# Altium schematic sheet ADCduinoModule.SchDoc: Название платы
size 594 x 420 mm; ApprovedBy: Рогов; CheckedBy: Фамилия проверяющего; DrawnBy: Фамилия разработчика; DocumentNumber: Введите номер платы + Э3; SheetNumber: пусто если листов 1, иначе 1; SheetTotal: количество листов; Format: A2; DocumentType: тип схемы; Title1str: (вторая строка при необходимости); ImagePath: Введите номер платы
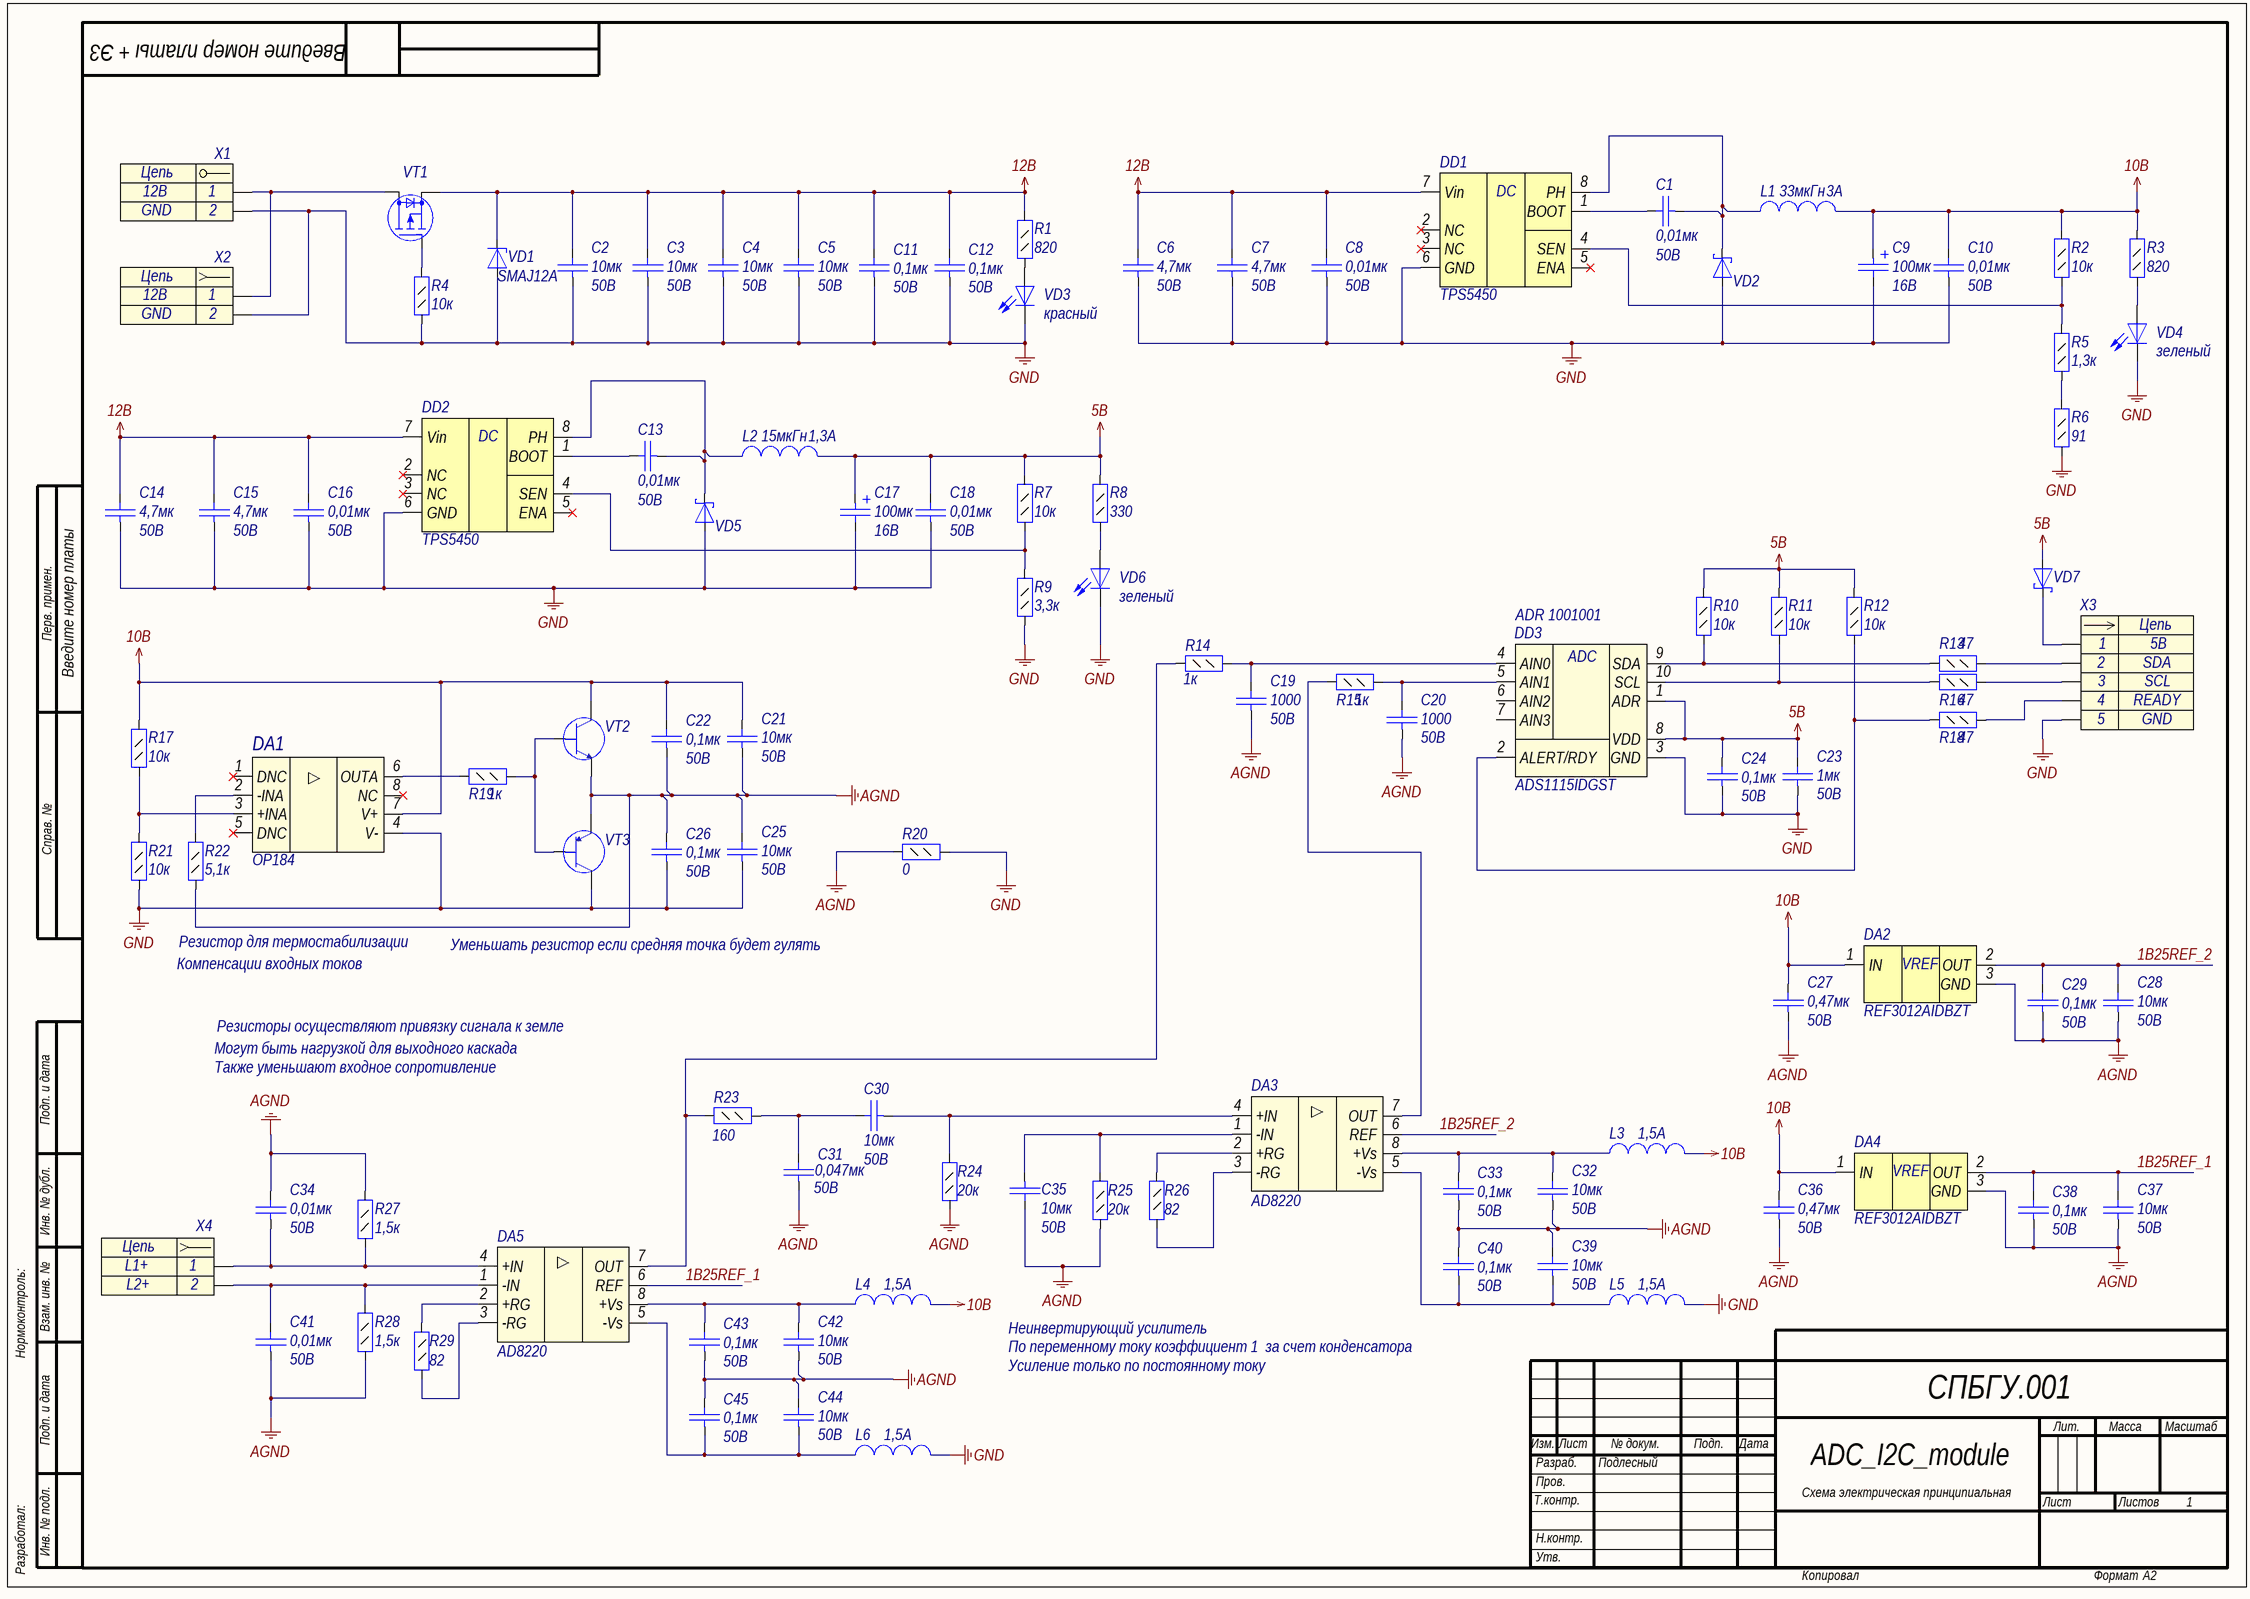
[diagram p0: ADCduinoModule.SchDoc]

## Parts
C1  value 0,01мк  Voltage: 50B  [C0805]  (hidden comment: Capacitor)
C2  value 10мк  Voltage: 50В  [C1210]  (hidden comment: Capacitor)
C3  value 10мк  Voltage: 50В  [C1210]  (hidden comment: Capacitor)
C4  value 10мк  Voltage: 50В  [C1210]  (hidden comment: Capacitor)
C5  value 10мк  Voltage: 50В  [C1210]  (hidden comment: Capacitor)
C6  value 4,7мк  Voltage: 50В  [C1206]  (hidden comment: Capacitor)
C7  value 4,7мк  Voltage: 50В  [C1206]  (hidden comment: Capacitor)
C8  value 0,01мк  Voltage: 50B  [C0805]  (hidden comment: Capacitor)
C9  value 100мк  Voltage: 16В  [TANTAL CASE D]  (hidden comment: Capacitor_pol)
C10  value 0,01мк  Voltage: 50B  [C0805]  (hidden comment: Capacitor)
C11  value 0,1мк  Voltage: 50B  [C0805]  (hidden comment: Capacitor)
C12  value 0,1мк  Voltage: 50B  [C0805]  (hidden comment: Capacitor)
C13  value 0,01мк  Voltage: 50B  [C0805]  (hidden comment: Capacitor)
C14  value 4,7мк  Voltage: 50В  [C1206]  (hidden comment: Capacitor)
C15  value 4,7мк  Voltage: 50В  [C1206]  (hidden comment: Capacitor)
C16  value 0,01мк  Voltage: 50B  [C0805]  (hidden comment: Capacitor)
C17  value 100мк  Voltage: 16В  [TANTAL CASE D]  (hidden comment: Capacitor_pol)
C18  value 0,01мк  Voltage: 50B  [C0805]  (hidden comment: Capacitor)
C19  value 1000  Voltage: 50В  [C0805]  (hidden comment: Capacitor)
C20  value 1000  Voltage: 50В  [C0805]  (hidden comment: Capacitor)
C21  value 10мк  Voltage: 50В  [C1210]  (hidden comment: Capacitor)
C22  value 0,1мк  Voltage: 50B  [C0805]  (hidden comment: Capacitor)
C23  value 1мк  Voltage: 50B  [C0805]  (hidden comment: Capacitor)
C24  value 0,1мк  Voltage: 50B  [C0805]  (hidden comment: Capacitor)
C25  value 10мк  Voltage: 50В  [C1210]  (hidden comment: Capacitor)
C26  value 0,1мк  Voltage: 50B  [C0805]  (hidden comment: Capacitor)
C27  value 0,47мк  Voltage: 50B  [C0805]  (hidden comment: Capacitor)
C28  value 10мк  Voltage: 50В  [C1210]  (hidden comment: Capacitor)
C29  value 0,1мк  Voltage: 50B  [C0805]  (hidden comment: Capacitor)
C30  value 10мк  Voltage: 50В  [C1210]  (hidden comment: Capacitor)
C31  value 0,047мк  Voltage: 50B  [C0805]  (hidden comment: Capacitor)
C32  value 10мк  Voltage: 50В  [C1210]  (hidden comment: Capacitor)
C33  value 0,1мк  Voltage: 50B  [C0805]  (hidden comment: Capacitor)
C34  value 0,01мк  Voltage: 50B  [C0805]  (hidden comment: Capacitor)
C35  value 10мк  Voltage: 50В  [C1210]  (hidden comment: Capacitor)
C36  value 0,47мк  Voltage: 50B  [C0805]  (hidden comment: Capacitor)
C37  value 10мк  Voltage: 50В  [C1210]  (hidden comment: Capacitor)
C38  value 0,1мк  Voltage: 50B  [C0805]  (hidden comment: Capacitor)
C39  value 10мк  Voltage: 50В  [C1210]  (hidden comment: Capacitor)
C40  value 0,1мк  Voltage: 50B  [C0805]  (hidden comment: Capacitor)
C41  value 0,01мк  Voltage: 50B  [C0805]  (hidden comment: Capacitor)
C42  value 10мк  Voltage: 50В  [C1210]  (hidden comment: Capacitor)
C43  value 0,1мк  Voltage: 50B  [C0805]  (hidden comment: Capacitor)
C44  value 10мк  Voltage: 50В  [C1210]  (hidden comment: Capacitor)
C45  value 0,1мк  Voltage: 50B  [C0805]  (hidden comment: Capacitor)
DA1  OP184  [SO8]
DA2  Part Number: REF3012AIDBZT  [SOT23-3]  (hidden comment: REF30xx)
DA3  AD8220  [MSOP8]
DA4  Part Number: REF3012AIDBZT  [SOT23-3]  (hidden comment: REF30xx)
DA5  AD8220  [MSOP8]
DD1  TPS5450  [SO Powerpad8]
DD2  TPS5450  [SO Powerpad8]
DD3  ADS1115IDGST  [MSOP10]
L1  value 33мкГн  Rated Current: 3A  [IND_12.8x12.8]  (hidden comment: Inductor)
L2  value 15мкГн  Rated Current: 1,3A  [SDR0604]  (hidden comment: Inductor)
L3  Rated Current: 1,5A  [L0603]  (hidden comment: Inductor)
L4  Rated Current: 1,5A  [L0603]  (hidden comment: Inductor)
L5  Rated Current: 1,5A  [L0603]  (hidden comment: Inductor)
L6  Rated Current: 1,5A  [L0603]  (hidden comment: Inductor)
R1  value 820  [R0805]  (hidden comment: Resistor_0,125Вт)
R2  value 10к  [R0805]  (hidden comment: Resistor_0,125Вт)
R3  value 820  [R0805]  (hidden comment: Resistor_0,125Вт)
R4  value 10к  [R0805]  (hidden comment: Resistor_0,125Вт)
R5  value 1,3к  [R0805]  (hidden comment: Resistor_0,125Вт)
R6  value 91  [R0805]  (hidden comment: Resistor_0,125Вт)
R7  value 10к  [R0805]  (hidden comment: Resistor_0,125Вт)
R8  value 330  [R0805]  (hidden comment: Resistor_0,125Вт)
R9  value 3,3к  [R0805]  (hidden comment: Resistor_0,125Вт)
R10  value 10к  [R0805]  (hidden comment: Resistor_0,125Вт)
R11  value 10к  [R0805]  (hidden comment: Resistor_0,125Вт)
R12  value 10к  [R0805]  (hidden comment: Resistor_0,125Вт)
R13  value 47  [R0805]  (hidden comment: Resistor_0,125Вт)
R14  value 1к  [R0805]  (hidden comment: Resistor_0,125Вт)
R15  value 1к  [R0805]  (hidden comment: Resistor_0,125Вт)
R16  value 47  [R0805]  (hidden comment: Resistor_0,125Вт)
R17  value 10к  [R0805]  (hidden comment: Resistor_0,125Вт)
R18  value 47  [R0805]  (hidden comment: Resistor_0,125Вт)
R19  value 1к  [R0805]  (hidden comment: Resistor_0,125Вт)
R20  value 0  [R0805]  (hidden comment: Resistor_0,125Вт)
R21  value 10к  [R0805]  (hidden comment: Resistor_0,125Вт)
R22  value 5,1к  [R0805]  (hidden comment: Resistor_0,125Вт)
R23  value 160  [R0805]  (hidden comment: Resistor_0,125Вт)
R24  value 20к  [R0805]  (hidden comment: Resistor_0,125Вт)
R25  value 20к  [R0805]  (hidden comment: Resistor_0,125Вт)
R26  value 82  [R0805]  (hidden comment: Resistor_0,125Вт)
R27  value 1,5к  [R0805]  (hidden comment: Resistor_0,125Вт)
R28  value 1,5к  [R0805]  (hidden comment: Resistor_0,125Вт)
R29  value 82  [R0805]  (hidden comment: Resistor_0,125Вт)
VD1  Part Number: SMAJ12A  [SMA]  (hidden comment: DiodeZener)
VD2  DiodeSchottky  [SMA]  (value not drawn)
VD3  красный  [L_0805]
VD4  зеленый  [L_0805]
VD5  DiodeSchottky  [SMA]  (value not drawn)
VD6  зеленый  [L_0805]
VD7  DiodeSchottky  [SMA]  (value not drawn)
VT1  P-MOSFET  [DPAK]  (value not drawn)
VT2  BJT NPN  [SOT-223]  (value not drawn)
VT3  BJT PNP  [SOT-223]  (value not drawn)
X1  Header_2_trm  [TERMINAL-2WAY-3.5MM]  (value not drawn)
X2  Header_2_sct  [DS-210]  (value not drawn)
X3  Header_5_plg  [PLS-5]  (value not drawn)
X4  Header_2_sct  [TAB_2PAD]  (value not drawn)

## Nets
5B: C17.1 C18.2 C23.2 C24.2 DD3.1(ADR) DD3.8(VDD) L2.2 R7.2 R8.2 R10.2 R11.2 R12.2 VD7.2(A)
10B: C9.1 C10.2 C21.2 C22.2 C27.2 C36.2 DA1.7(V+) DA2.1(IN) DA4.1(IN) L1.2 L3.2 L4.2 R2.2 R3.2 R17.2 VT2.3
12B: C2.2 C3.2 C4.2 C5.2 C6.2 C7.2 C8.2 C11.2 C12.2 C14.2 C15.2 C16.2 DD1.7(Vin) DD2.7(Vin) R1.2 VD1.1(K) VT1.3(S)
AGND: C19.1 C20.1 C21.1 C22.1 C25.2 C26.2 C27.1 C28.1 C29.1 C31.1 C32.1 C33.1 C34.2 C35.2 C36.1 C37.1 C38.1 C39.2 C40.2 C41.1 C42.1 C43.1 C44.2 C45.2 DA2.3(GND) DA4.3(GND) R20.1 R22.1 R24.1 R25.1 R27.2 R28.1 VT2.2 VT3.2
GND: C2.1 C3.1 C4.1 C5.1 C6.1 C7.1 C8.1 C9.2 C10.1 C11.1 C12.1 C14.1 C15.1 C16.1 C17.2 C18.1 C23.1 C24.1 C25.1 C26.1 DA1.4(V-) DD1.6(GND) DD2.6(GND) DD3.3(GND) L5.2 L6.2 R4.1 R6.1 R9.1 R20.2 R21.1 VD1.2(A) VD2.2(A) VD3.1(K) VD4.1(K) VD5.2(A) VD6.1(K) VT3.3 X1.2 X2.2 X3.5
1B25REF_1: C37.2 C38.2 DA4.2(OUT) DA5.6(REF)
1B25REF_2: C28.2 C29.2 DA2.2(OUT) DA3.6(REF)
NetC1_1: C1.1 DD1.8(PH) L1.1 VD2.1(K)
NetC1_2: C1.2 DD1.1(BOOT)
NetC13_1: C13.1 DD2.8(PH) L2.1 VD5.1(K)
NetC13_2: C13.2 DD2.1(BOOT)
NetC19_2: C19.2 DD3.4(AIN0) R14.2
NetC20_2: C20.2 DD3.5(AIN1) R15.2
NetC30_1: C30.1 DA3.4(+IN) R24.2
NetC30_2: C30.2 C31.2 R23.2
NetC32_2: C32.2 C33.2 DA3.8(+Vs) L3.1
NetC34_1: C34.1 DA5.4(+IN) R27.1 X4.1
NetC35_1: C35.1 DA3.1(-IN) R25.2
NetC39_1: C39.1 C40.1 DA3.5(-Vs) L5.1
NetC41_2: C41.2 DA5.1(-IN) R28.2 X4.2
NetC42_2: C42.2 C43.2 DA5.8(+Vs) L4.1
NetC44_1: C44.1 C45.1 DA5.5(-Vs) L6.1
NetDA1_2: DA1.2(-INA) R22.2
NetDA1_3: DA1.3(+INA) R17.1 R21.2
NetDA1_6: DA1.6(OUTA) R19.1
NetDA3_2: DA3.2(+RG) R26.1
NetDA3_3: DA3.3(-RG) R26.2
NetDA3_7: DA3.7(OUT) R15.1
NetDA5_2: DA5.2(+RG) R29.1
NetDA5_3: DA5.3(-RG) R29.2
NetDA5_7: DA5.7(OUT) R14.1 R23.1
NetDD1_4: DD1.4(SEN) R2.1 R5.2
NetDD2_4: DD2.4(SEN) R7.1 R9.2
NetDD3_2: DD3.2(ALERT/RDY) R12.1 R18.1
NetDD3_9: DD3.9(SDA) R10.1 R13.1
NetDD3_10: DD3.10(SCL) R11.1 R16.1
NetR1_1: R1.1 VD3.2(A)
NetR3_1: R3.1 VD4.2(A)
NetR4_2: R4.2 VT1.1(G)
NetR5_1: R5.1 R6.2
NetR8_1: R8.1 VD6.2(A)
NetR13_2: R13.2 X3.2
NetR16_2: R16.2 X3.3
NetR18_2: R18.2 X3.4
NetR19_2: R19.2 VT2.1 VT3.1
NetVD7_1: VD7.1(K) X3.1
NetVT1_2: VT1.2(D) X1.1 X2.1

Not connected (* = marked no-connect by the designer): DA1 1(DNC)* 5(DNC)* 8(NC)*; DD1 2(NC)* 3(NC)* 5(ENA)*; DD2 2(NC)* 3(NC)* 5(ENA)*; DD3 6(AIN2) 7(AIN3)

## Notes on the sheet
- Перв. примен.
- (near DD3) ADR 1001001
- Справ. №
- Компенсации входных токов
- Резистор для термостабилизации
- Уменьшать резистор если средняя точка будет гулять
- Могут быть нагрузкой для выходного каскада
- Также уменьшают входное сопротивление
- Резисторы осуществляют привязку сигнала к земле
- Подп. и дата
- Инв. № дубл.
- Нормоконтроль:
- Взам. инв. №
- Неинвертирующий усилитель
- По переменному току коэффициент 1  за счет конденсатора
- Усиление только по постоянному току
- СПБГУ.001
- Изм.
- Лист
- № докум.
- Подп.
- Дата
- Лит.
- Масса
- Масштаб
- Т.контр.
- Пров.
- Разраб.
- Подлесный
- Схема электрическая принципиальная
- ADC_I2C_module
- Листов
- 1
- Разработал:
- Инв. № подл.
- Н.контр.
- Утв.
- Копировал
- Формат
- (in symbol connect1) Цепь
- (in symbol connect6) Цепь
- (in symbol connect34) Цепь
- (in symbol connect57) Цепь
- (in symbol interf6) ADC
- (in symbol pwr12) DC
- (in symbol REF3012AIDBZT) VREF

## Library data of the parts
C1 C8 C10 C13 C16 C18 C34 C41 = cap136: Конденсатор; Part Name: Ceramic; Manufacture: Murata; Part Number: GRM216R71H103K; id: cap136; TKE: X7R
C2-C5 C21 C25 C28 C30 C32 C35 C37 C39 C42 C44 = cap205: Конденсатор; Part Name: Ceramic; Manufacture: Murata; Part Number: GRM32ER71H106K; id: cap205; TKE: X7R
C6 C7 C14 C15 = cap188: Конденсатор; Part Name: Ceramic; Manufacture: Murata; Part Number: GRM31CR71H475KA12L; id: cap188; TKE: X7R
C9 C17 = cap209: Конденсатор полярный; Part Name: Tantal; Manufacture: Vishay; Part Number: 293D107X9016D2TE3; id: cap209
C11 C12 C22 C24 C26 C29 C33 C38 C40 C43 C45 = cap141: Конденсатор; Part Name: Ceramic; Manufacture: Murata; Part Number: GRM21BR71H104K**; id: cap141; TKE: X7R
C19 C20 = cap165: Конденсатор; Part Name: Ceramic; Manufacture: Murata; Part Number: GRM216R71H102K*; id: cap165; TKE: X7R
C23 = cap151: Конденсатор; Part Name: Ceramic; Manufacture: Murata; Part Number: GRM21BR71H105K; id: cap151; TKE: X7R
C27 C36 = cap148: Конденсатор; Part Name: Ceramic; Manufacture: Murata; Part Number: GRM219R71C474K; id: cap148; TKE: X7R
C31 = cap140: Конденсатор; Part Name: Ceramic; Manufacture: Murata; Part Number: GRM21BR71H473K; id: cap140; TKE: X7R
DA1 = amp16: Precision Rail-to-Rail / Input and Output Operational Amplifiers; Part Number: OP184ESZ; Manufacture: Analog Devices; id: amp16; Rail-to-rail: yes; Supply Voltage: 3-36B; Supply Current max: 1,45mA; Bandwidth: 3,25MHz; Input Bias Current: 60nA; CMRR: 86dB; PSRR: 76dB; Offset voltage: 165uB; Channels: 1; Part Name: Precision Rail-to-Rail Input and Output
DA2 DA4 = REF3012AIDBZT: CMOS Voltage Reference; Manufacturer: Texas Instruments; id: ref2; Voltage min stabilize: 1,25B; Max input voltage: 5,5B; Accuracy: 0,002; Output current: 25mA; Part Name: CMOS Voltage Reference
DA3 DA5 = amp15: JFET Input Instrumentation Amplifier; Part Number: AD8220ARMZ; Manufacture: Analog Devices; id: amp15; Rail-to-rail: yes; Supply Voltage: 4,5В–36В or (+-)2,25В-(+-)18B; Supply Current max: 750uA; Bandwidth: 1,5MHz; Input Bias Current: 25pA; CMRR: 95dB; PSRR: 100dB; Offset voltage: (+-)0,125uB; Channels: 1; Part Name: JFET Input Instrumentation Amplifier
DD1 DD2 = pwr12: 5-A, Wide Input Range, Step-Down Converter; Manufacturer: Texas Instruments; id: pwr12; Input Voltage: 5,5 - 36B; Output Voltage: Adj; Current: 5A; Part Name: Step-Down Converter; Type: Impulse; Part Number: TPS5450
DD3 = interf6: Ultra-Small, Low-Power, 16-Bit  Analog-to-Digital Converter with Internal Reference; Part Name: ADC - I2C; Manufacture: Texas Instruments; Resolution: 16bit; Address: ADDR pin; Sample frequence: 0,86k; Number of Channel: 4; Input channel: 4single 2diff; Type Supply: Single Polar; Current Consumption: 150uA; Power Supply: 2-5.5V; id: interf6; Part Number: ADS1115IDGST
L1 = ind80: EMI Suppression Filter; Part Name: SMD Power Inductors; Part Number: B82477G4333M000; Manufacture: Epcos; id: ind80; Saturation Current: 3,5A; Resistance: 0,053Ohm
L2 = ind44: EMI Suppression Filter; Part Name: SMD Power Inductors; Part Number: SDR0604- 150YL; Manufacture: Bourns; id: ind44; Saturation Current: 1,6A; Resistance: 0,14Ohm
L3-L6 = ind0: EMI Suppression Filter; Part Name: EMI Suppression Filters; Part Number: BLM18PG181SN1D; id: ind0; Resistance: 0,09Ohm
R1 R3 = res71: Резистор; Manufacture: Yageo; Part Number: RC0805FR-07820RL; id: res71; Accuracy: 0,01; Part Name: Resistor; Power: 0,125Вт
R2 R4 R7 R10-R12 R17 R21 = res97: Резистор; Manufacture: Yageo; Part Number: RC0805FR-0710KL; id: res97; Accuracy: 0,01; Part Name: Resistor; Power: 0,125Вт
R5 = res76: Резистор; Manufacture: Yageo; Part Number: RC0805FR-071K3; id: res76; Accuracy: 0,01; Part Name: Resistor; Power: 0,125Вт
R6 = res48: Резистор; Manufacture: Yageo; Part Number: RC0805FR-0791RL; id: res48; Accuracy: 0,01; Part Name: Resistor; Power: 0,125Вт
R8 = res61: Резистор; Manufacture: Yageo; Part Number: RC0805FR-07330RL; id: res61; Accuracy: 0,01; Part Name: Resistor; Power: 0,125Вт
R9 = res85: Резистор; Manufacture: Yageo; Part Number: RC0805FR-072K3; id: res85; Accuracy: 0,01; Part Name: Resistor; Power: 0,125Вт
R13 R16 R18 = res41: Резистор; Manufacture: Yageo; Part Number: RC0805FR-0747RL; id: res41; Accuracy: 0,01; Part Name: Resistor; Power: 0,125Вт
R14 R15 R19 = res73: Резистор; Manufacture: Yageo; Part Number: RC0805FR-071KL; id: res73; Accuracy: 0,01; Part Name: Resistor; Power: 0,125Вт
R20 = res0: Резистор; Manufacture: Yageo; Part Number: RC0805FR-070RL; id: res0; Accuracy: 0,01; Part Name: Resistor; Power: 0,125Вт
R22 = res90: Резистор; Manufacture: Yageo; Part Number: RC0805FR-075K1; id: res90; Accuracy: 0,01; Part Name: Resistor; Power: 0,125Вт
R23 = res54: Резистор; Manufacture: Yageo; Part Number: RC0805FR-07160RL; id: res54; Accuracy: 0,01; Part Name: Resistor; Power: 0,125Вт
R24 R25 = res104: Резистор; Manufacture: Yageo; Part Number: RC0805FR-0720KL; id: res104; Accuracy: 0,01; Part Name: Resistor; Power: 0,125Вт
R26 R29 = res47: Резистор; Manufacture: Yageo; Part Number: RC0805FR-0782RL; id: res47; Accuracy: 0,01; Part Name: Resistor; Power: 0,125Вт
R27 R28 = res77: Резистор; Manufacture: Yageo; Part Number: RC0805FR-071K5; id: res77; Accuracy: 0,01; Part Name: Resistor; Power: 0,125Вт
VD1 = SMAJ12A: Cтабилитрон (лавинный выпрямительный диод) односторонний; Part Name: TVS diode Unidirectional; Manufacture: ST Microelectronics; id: tvs128; Leakage Current: 0,2uA; Stand-off Voltage: 12B; Breakdown Voltage: 14B; Clamping voltage: 19,9B; Dynamic resistance: 0,259Ohm; Peak Pulse Power: 400W; Number of diodes: 1
VD2 VD5 VD7 = diode1: Диод Шоттки; Part Number: SK34A; Manufacture: Taiwan Semiconductor; id: diode1; Max Reverse Voltage: 40B; Forward Voltage: 0,55B; Forward Current: 3A; Part Name: Diode Schottky
VD3 = diode5: Светодиод; Part Number: KP-2012EC; id: diode5; Part Name: LED
VD4 VD6 = diode5: Светодиод; Part Number: KP-2012MGC; id: diode5; Part Name: LED
VT1 = trans8: N-MOSFET; Part Number: FDD6637; Manufacturer: Fairchild Semiconductor; id: trans8; Structure: p-channel; V drain-source max: (-35B); Rds: 0,0116Ohm; Gate-to-source voltage: (+-)25B; Continuous drain current: (-55)A; Pulsed drain current: (-100)A; Power dissipation: 57W
VT2 = bjt3: Part Name: Transistor; Part Number: PBSS4540Z.115; Manufacture: NXP Semiconductor; id: bjt3; hfe: 300; Vceo max: 40В; Ic max: 5А; Power: 2Вт; Frequency: 130МГц; Structure: npn
VT3 = bjt4: Part Name: Transistor; Part Number: PBSS5540Z.115; Manufacture: NXP Semiconductor; id: bjt4; hfe: 300; Vceo max: 40В; Ic max: 5А; Power: 2Вт; Frequency: 130МГц; Structure: pnp
X1 = connect34: Разъем - 2 конт. клеммник; Part Name: TERMINAL BLOCK 2 way; Contact_1: 12B; Contact_2: GND; Etch: 3.5mm; id: connect34
X2 = connect1: Разъем - 2 конт. розетка; Part Name: DC Power Jack; Part Number: DS-210B(PBT)(NB); Contact_1: 12B; Contact_2: GND; id: connect1
X3 = connect6: Разъем - 5 конт. вилка; Part Number: DS1021-1*5SF112-B; Manufacture: Ningbo connfly electronic; Contact_1: 5B; Contact_2: SDA; Contact_3: SCL; Contact_4: READY; Contact_5: GND; Etch: 2,54mm; Part Name: PLS-5; id: connect6
X4 = connect57: Разъем - 2 конт. розетка; Part Name: Place for wires; Contact_1: L1+; Contact_2: L2+; id: connect57